# EAGLE design tiny13_charlie4_50mm_AAA_optical_diag_DIP (EAGLE 6.2)
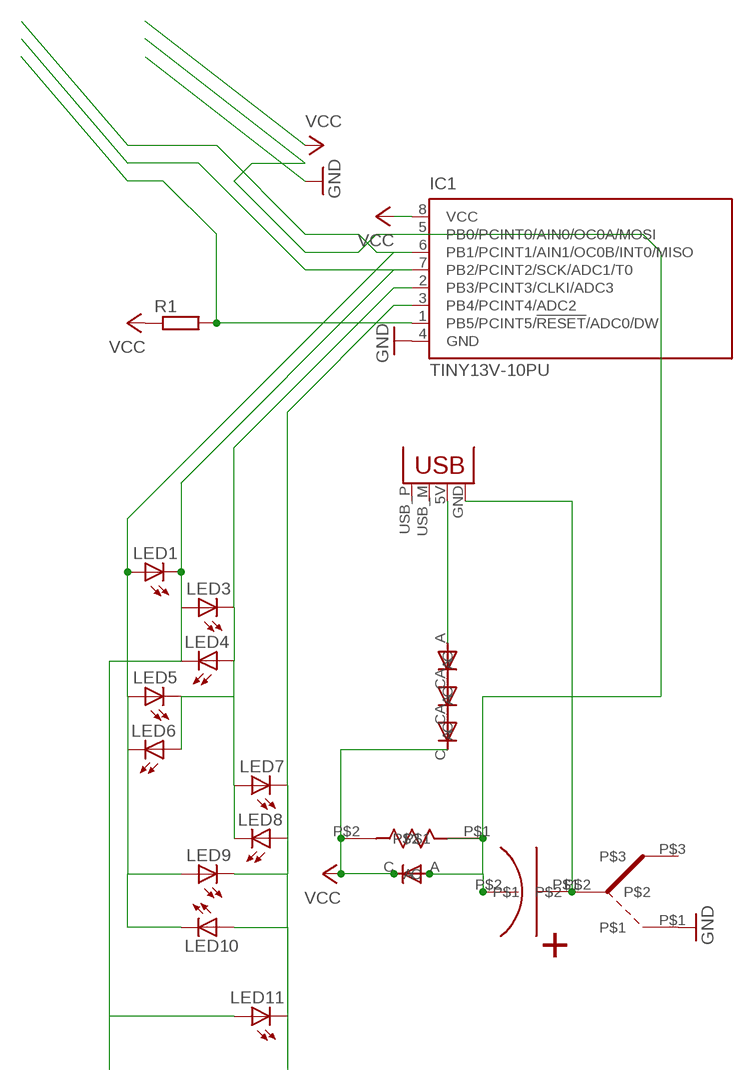
[diagram p0: schematic, sheet 1]

## Parts
IC1  TINY13V-10PU  [DIL08]
LED1  LED3MM  [LED3MM]
LED3  LED3MM  [LED3MM]
LED4  LED3MM  [LED3MM]
LED5  LED3MM  [LED3MM]
LED6  LED3MM  [LED3MM]
LED7  LED3MM  [LED3MM]
LED8  LED3MM  [LED3MM]
LED9  LED3MM  [LED3MM]
LED10  LED3MM  [LED3MM]
LED11  LED3MM  [LED3MM]
R1  R-EU_0204/5  [0204/5]
U$1  R-6  [R-6]
U$2  D-6  [D-7.5]
U$3  D-6  [D-7.5]
U$5  NICHICON_12F  [NICHICON_10X30]
U$6  D-6  [D-7.5]
U$7  D-6  [D-7.5]
U$8  SPST_SWITCH_MICRO_PTH  [SPSTMICRO]
X1  USBPCB  [USB-A-PCB]

## Nets
GND: IC1.4(GND) U$8.P$1
N$1: IC1.2(PB3/PCINT3/CLKI/ADC3) LED3.K(C) LED4.A LED5.K(C) LED6.A LED7.A LED8.K(C)
N$2: IC1.7(PB2/PCINT2/SCK/ADC1/T0) LED1.K(C) LED3.A LED4.K(C) LED11.A
N$4: IC1.3(PB4/PCINT4/ADC2) LED7.K(C) LED8.A LED9.K(C) LED10.A LED11.K(C)
N$5: IC1.5(PB0/PCINT0/AIN0/OC0A/MOSI)
N$6: IC1.1(PB5/PCINT5/!RESET!/ADC0/DW) R1.2
N$7: U$5.P$1 U$8.P$2 X1.GND
N$8: IC1.6(PB1/PCINT1/AIN1/OC0B/INT0/MISO) LED1.A LED5.A LED6.K(C) LED9.A LED10.K(C)
N$10: U$1.P$1 U$5.P$2 U$7.A
N$11: U$2.C U$3.A
N$12: U$3.C U$6.A
N$13: U$2.A X1.5V(VBUS)
VCC: IC1.8(VCC) R1.1 U$1.P$2 U$6.C U$7.C
Unconnected: U$8.P$3 X1.USB_M(D-) X1.USB_P(D+)

## Library data of the parts
IC1 = atmel:TINY13: 8-bit AVR Microcontroller with 1K Bytes In-System Programmable Flash Source: http://www.atmel.com/dyn/resources/prod_documents/2535S.pdf; MPN: ATTINY13V-10PU; OC_FARNELL: 9171576; OC_NEWARK: 96K6523
LED1 LED3-LED11 = 0-svo:LED: LED OSRAM: - CHIPLED LG R971, LG N971, LY N971, LG Q971, LY Q971, LO R971, LY R971 LH N974, LH R974 LS Q976, LO Q976, LY Q976 LO Q996 - Hyper CHIPLED LW Q18S LB Q993, LB Q99A, LB R99A - SideLED LS A670, LO A670, LY A670, LG A670, LP A670 LB A673, LV A673, LT A673, LW A673 LH A674 LY A675 LS A676, LA A676, LO A676, LY A676, LW A676 LS A679, LY A679, LG A679 - Hyper Micro SIDELED® LS Y876, LA Y876, LO Y876, LY Y876 LT Y87S - SmartLED LW L88C, LW L88S LB L89C, LB L89S, LG L890 LS L89K, LO L89K, LY L89K LS L896, LA L896, LO L896, LY L896 - TOPLED LS T670, LO T670, LY T670, LG T670, LP T670 LSG T670, LSP T670, LSY T670, LOP T670, LYG T670 LG T671, LOG T671, LSG T671 LB T673, LV T673, LT T673, LW T673 LH T674 LS T676, LA T676, LO T676, LY T676, LB T676, LH T676, LSB T676, LW T676 LB T67C, LV T67C, LT T67C, LS T67K, LO T67K, LY T67K, LW E67C LS E67B, LA E67B, LO E67B, LY E67B, LB E67C, LV E67C, LT E67C LW T67C LS T679, LY T679, LG T679 LS T770, LO T770, LY T770, LG T770, LP T770 LB T773, LV T773, LT T773, LW T773 LH T774 LS E675, LA E675, LY E675, LS T675 LS T776, LA T776, LO T776, LY T776, LB T776 LHGB T686 LT T68C, LB T68C - Hyper Mini TOPLED® LB M676 - Mini TOPLED Santana® LG M470 LS M47K, LO M47K, LY M47K Source: http://www.osram.convergy.de/
R1 = resistor:R-EU_: RESISTOR, European symbol
U$1 = Mrule:R-6
U$2 U$3 U$6 U$7 = Mrule:D-6
U$5 = Mrule:NICHICON_12F
U$8 = Mrule:SPST_SWITCH_MICRO_PTH
X1 = SparkFun:USB: USB Connectors USB-B-PTH is fully proven SKU : PRT-00139 USB-miniB is fully proven SKU : PRT-00587 USB-A-PCB is untested. USB-A-H is throughly reviewed, but untested. Spark Fun Electronics SKU : PRT-00437 USB-B-SMT is throughly reviewed, but untested. Needs silkscreen touching up. USB-A-S has not been used/tested USB-MB-H has not been used/tested

## Board
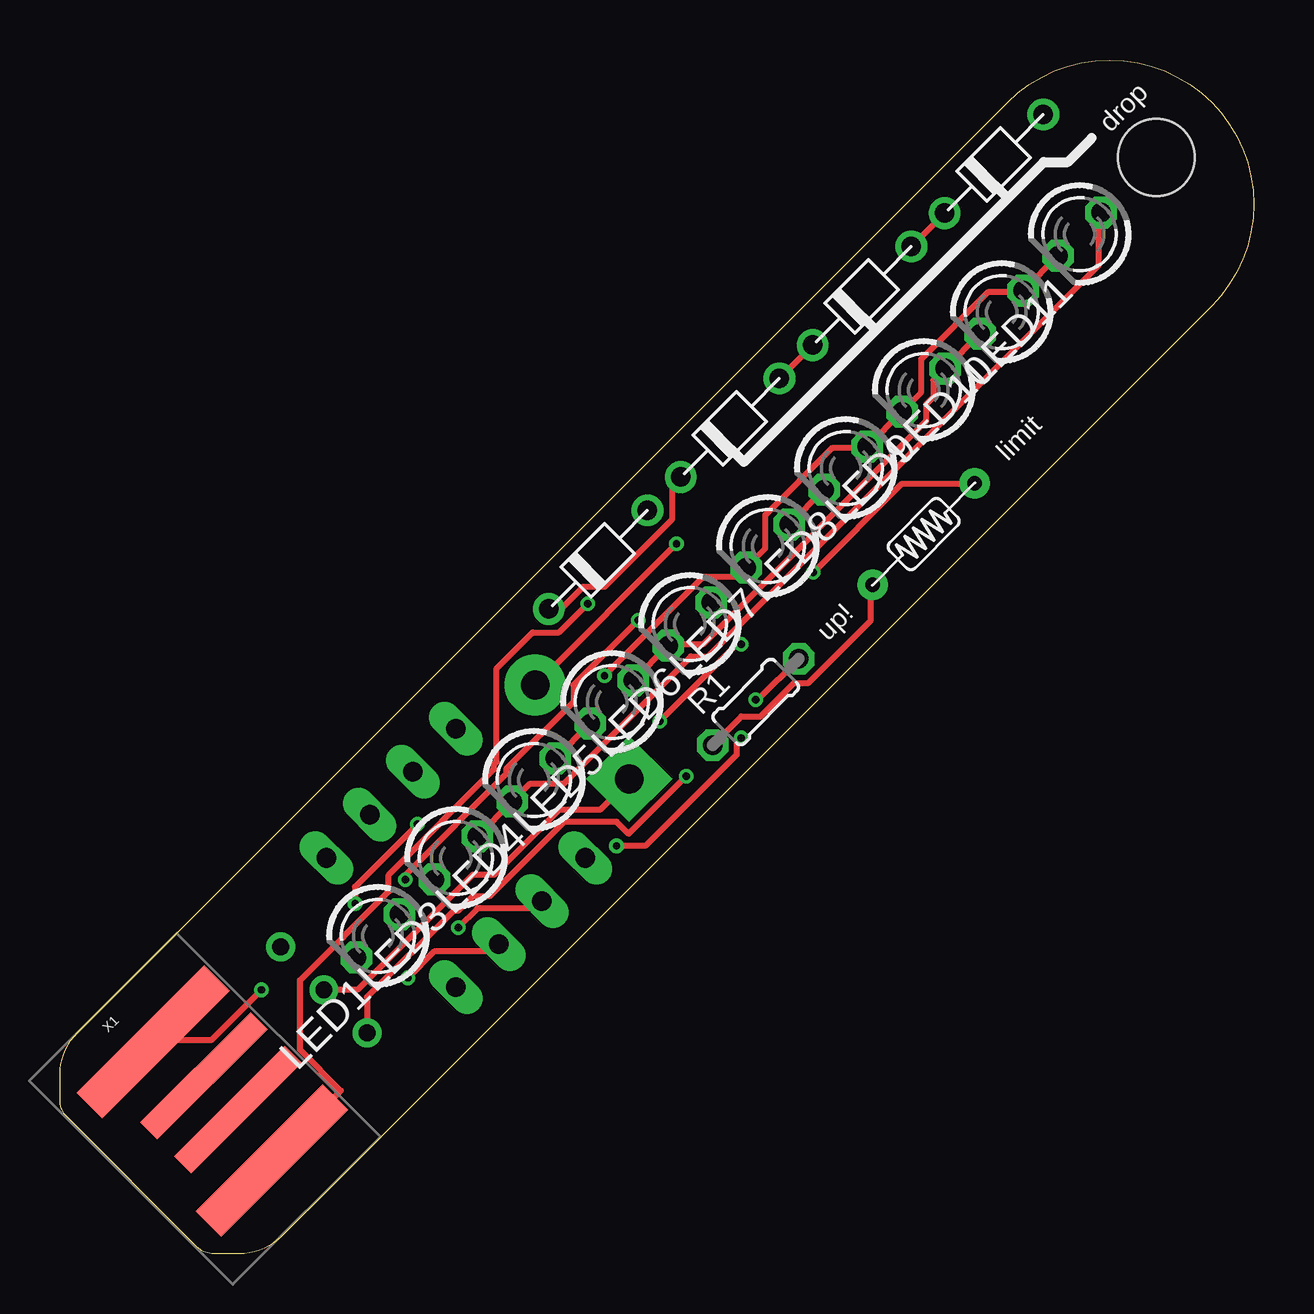
[diagram p1: board, top side]
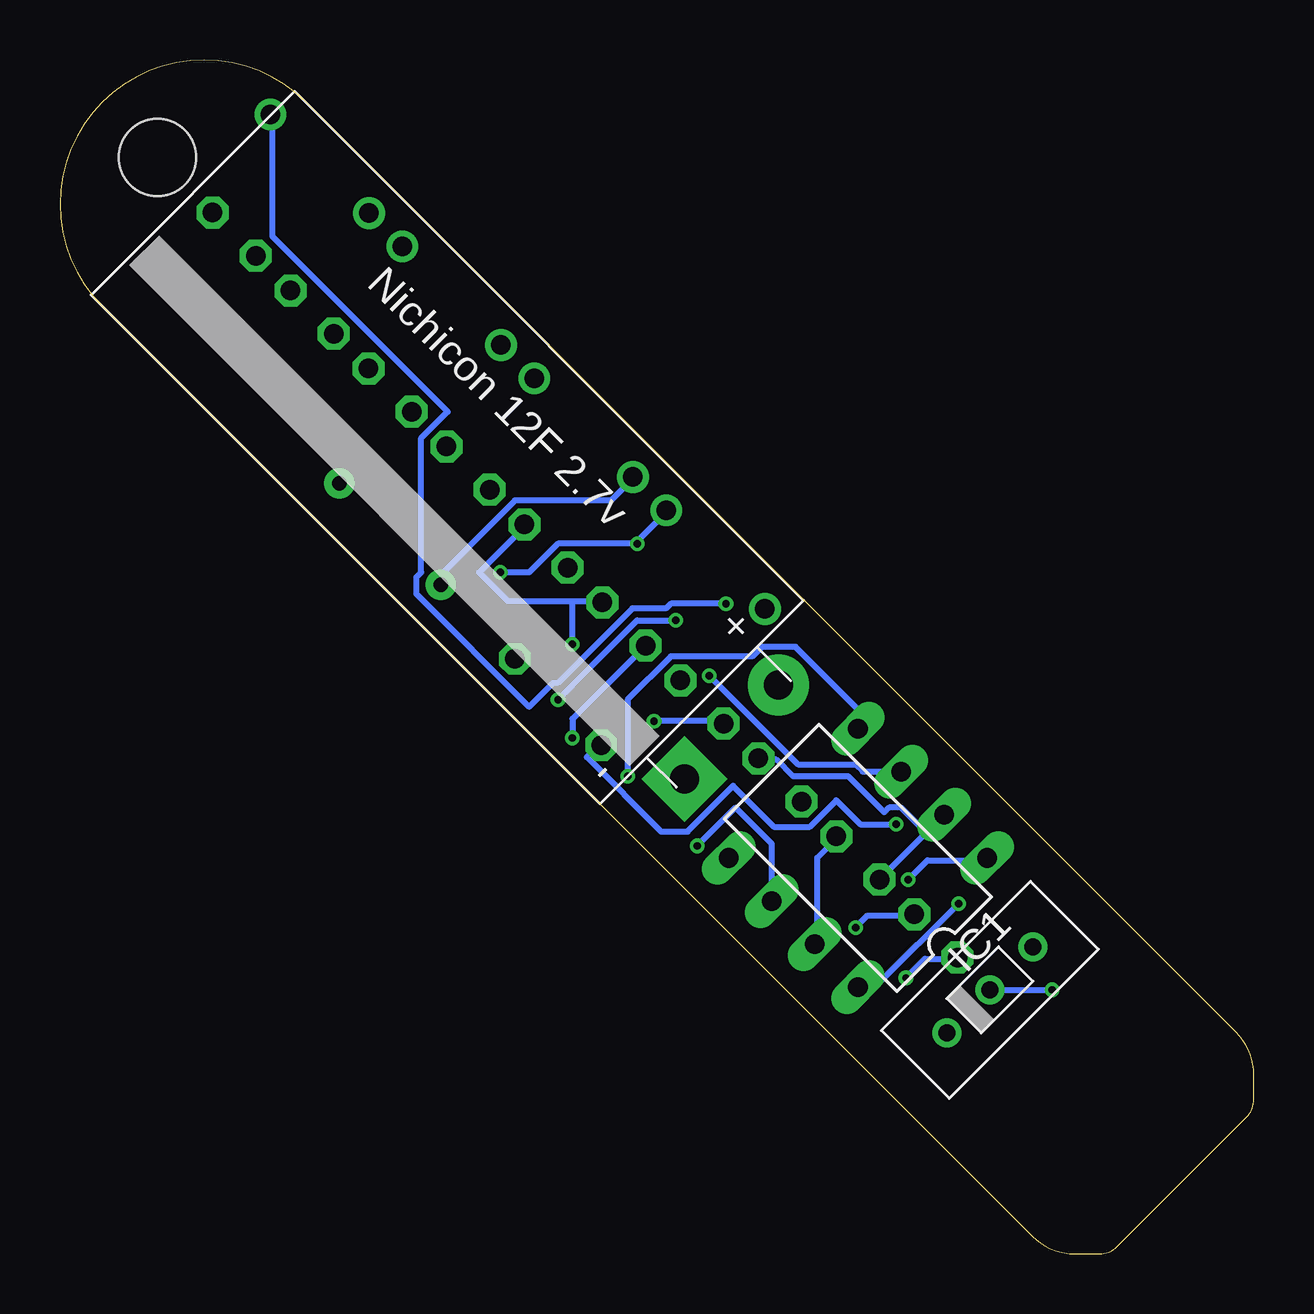
[diagram p2: board, bottom side, seen from below]

Size 49.76 x 49.76 mm. Coordinates in mm from the lower left corner, seen from the top.
Outline: 0.73,9.23 39.5,48 arc-180 48,39.5 9.23,0.73 arc-45 7.46,0 6.41,0 arc-45 5.71,0.29 0.29,5.71 arc-45 0,6.41 0,7.46 arc-45 0.73,9.23
Copper layers (1*16): Top 0.035mm / dielectric 1.5mm / Bottom 0.035mm
Design rules: minimum track width 10mil, minimum drill 12mil, track to track 7mil, track to pad 7mil, pad to pad 7mil, via to via 7mil, smd to smd 0mil, copper to edge 20mil, drill to drill 10mil, minimum pad ring 10mil, minimum via ring 6mil, stop-mask expansion 2mil, vias tented up to drill 100mil, thermal gap 10mil
Holes 3.2 mm at 45.7,45.7

### Footprints (pad centres in the part's own frame; a part is rotated, then mirrored left to right if it is on the bottom)
DIL08 = drill 0.813 long: 1 -3.81,-3.81; 2 -1.27,-3.81; 3 1.27,-3.81; 4 3.81,-3.81; 5 3.81,3.81; 6 1.27,3.81; 7 -1.27,3.81; 8 -3.81,3.81
LED3MM = drill 0.813 octagon: A -1.27,0; K 1.27,0
0204/5 = drill 0.813 octagon: 1 -2.54,0; 2 2.54,0
R-6 = drill 0.6 pad 1.27: P$1 -3,0; P$2 3,0
D-7.5 = drill 0.813: A 2.81,0; C -3,0
NICHICON_10X30 = drill 1.2 pad 2.54 square: P$1 3.23,-1.75 | drill 1.2 pad 2.54: P$2 8.77,-1.75
SPSTMICRO = drill 0.7: P$1 -2.54,0; P$2 0,0; P$3 2.54,0
USB-A-PCB = smd 7.5 x 1.5: 5V -0.2,-3.5; GND -0.2,3.5 | smd 6.5 x 1: USB_M 0.3,-1; USB_P 0.3,1

### Placement (x,y rotation side)
IC1  16.5,16.5 135 bottom
LED1  13.25,13.25 225 top
LED3  16.5,16.5 225 top
LED4  19.75,19.75 225 top
LED5  23,23 225 top
LED6  26.25,26.25 225 top
LED7  29.5,29.5 225 top
LED8  32.75,32.75 225 top
LED9  36,36 225 top
LED10  39.25,39.25 225 top
LED11  42.5,42.5 225 top
R1  29,23 45 top
U$1  36,30 225 top
U$2  39,45.5 45 top
U$3  33.5,40 45 top
U$5  27.25,18.75 45 bottom
U$6  28,34.5 45 top
U$7  22.5,29 45 top
U$8  11,11 45 bottom
X1  6.5,6.5 45 top

### Tracks (layer width: path | path; a pad name or v marks a point on that pad's centre or on a via)
GND  (via drill 0.3)
  Top 0.254: v26.1,19.9 23.7,17.5 23.2,18 21,18 17.9,14.9 17.2,14.9 16.6,14.3 16.4,14.3 12.8,10.7 12.8,9.3 U$8.P$1
  Bottom 0.254: v26.1,19.9 26.1,23.1 24.3,24.9 20.9,24.9 20.5,25.3 19.1,25.3 16.1,22.3 IC1.4
N$1  (via drill 0.3)
  Top 0.254: LED7.A LED8.K | LED5.K LED4.A | v28.4,25.4 28.2,25.4 v25,22.2
  Bottom 0.254: 28.4,27.2 31.1,27.2 32.3,28.4 30.4,30.3 LED7.A | 28.4,27.2 27.2,27.2 LED6.A | LED3.K 15.6,15.7 15.5,15.7 13,18.2 IC1.2 13.7,17.6 14.7,18.6 15.2,18.6 15.4,18.4 16.9,19.9 19.2,19.9 19.9,20.6 20.6,20.6 LED4.A | v28.4,25.4 28.4,27.2 | v25,22.2 22.2,22.2 LED5.K
N$2  (via drill 0.3)
  Top 0.254: v14.5,11.5 15.6,12.6 17.9,12.6 18.2,12.9 IC1.7 | LED3.A LED4.K 19.6,19.6 21,19.6 26.3,24.9 27,24.9 43.3,41.2 43.3,43.3 LED11.A
  Bottom 0.254: v14.5,11.5 13.7,12.3 12.4,12.3 LED1.K | IC1.7 18.2,13 18.2,16.5 17.4,17.3 LED3.A
N$4  (via drill 0.3)
  Top 0.254: LED11.K LED10.A 40.1,40.1 38.7,40.1 35.9,37.3 35.9,35.9 LED9.K LED8.A 33.6,33.6 32.2,33.6 29.4,30.8 29.4,29.4 LED7.K 28.2,28.2 26.8,28.2 v22.7,24.1
  Bottom 0.254: v22.7,24.1 19,20.4 16.6,20.4 16.3,20.1 14.8,20.1 IC1.3
N$6  (via drill 0.3)
  Top 0.254: v14.4,15.6 14.4,15.8 18.6,20 18.6,20.2 21.4,23 21.4,23.7 v24.1,26.4 | v29,23.1 29.1,23.1 R1.2
  Bottom 0.254: v14.4,15.6 13.6,16.4 11.2,16.4 IC1.1 | v24.1,26.4 25.7,26.4 v29,23.1
N$7  (via drill 0.3)
  Top 0.254: U$8.P$2 12.4,11 17.2,15.8 18.1,15.8 20.8,18.5 22.5,18.5 23.7,19.7 U$5.P$1 | v8.4,11 6.3,8.9 3.9,8.9 X1.GND
  Bottom 0.254: U$8.P$2 v8.4,11
N$8  (via drill 0.3)
  Top 0.254: v16.6,13.6 17.4,14.4 19.7,14.4 20,14.7 IC1.6 | LED5.A LED6.K 25.4,25.4 26.8,25.4 36.1,34.7 36.1,35.4 36.4,35.7 36.4,36.4 LED9.A LED10.K | v23.2,17 24.4,17 28.2,20.8 28.2,21.3 v28.4,21.5
  Bottom 0.254: v16.6,13.6 16.1,14.1 14.2,14.1 LED1.A | v23.2,17 21.6,18.6 20.1,17.1 20.1,14.8 IC1.6 | v28.4,21.5 28.4,22.3 25.4,25.3 LED6.K
N$10  (via drill 0.3)
  Top 0.254: v31.4,28.4 35.1,32.1 38.1,32.1 U$1.P$1 | v25.7,29.6 19.9,23.8 U$5.P$2
  Bottom 0.254: v31.4,28.4 30.2,28.4 29,29.6 25.8,29.6 | 25.8,29.6 24.5,30.9 U$7.A | v25.7,29.6 25.8,29.6
N$11
  Top 0.254: U$2.C U$3.A
N$12
  Top 0.254: U$3.C U$6.A
N$13  (via drill 0.3)
  Top 0.254: v22,27.1 20.8,25.9 19.7,25.9 18.2,24.4 18.2,20.5 18.1,20.4 18.1,20.2 13.7,15.8 13.7,15.1 10,11.4 10,8.5 11.7,6.8 8.8,3.9 X1.5V
  Bottom 0.254: v22,27.1 24.3,27.1 24.5,26.9 25.9,26.9 29,23.8 29.2,23.8 30.2,22.8 34.9,27.5 34.9,28.2 34.7,28.4 34.7,34 33.6,35.1 40.9,42.4 40.9,47.4 U$2.A
VCC  (via drill 0.3)
  Top 0.254: U$6.C 25.5,32 25.5,30.6 22.7,27.8 21.8,27.8 20.9,26.9 20.4,26.9 U$7.C | v12.3,14.6 12.3,15.3 v14.9,17.9 | R1.1 28.4,22.4 29.2,22.4 30.6,23.8 31.2,23.8 33.8,26.4 33.8,27.8 U$1.P$2
  Bottom 0.254: U$1.P$2 33.8,27.9 33.8,28.4 30.8,31.4 26.8,31.4 25.9,32.3 U$6.C | v12.3,14.6 15.7,11.2 16.5,11.2 IC1.8 | v14.9,17.9 16.4,17.9 17.4,18.9 18.5,17.8 20,17.8 21.7,19.5 23.6,17.6 24.7,17.6 27.8,20.7 27.3,21.2 R1.1

### Text on the board
tPlace: drop | limit | up!